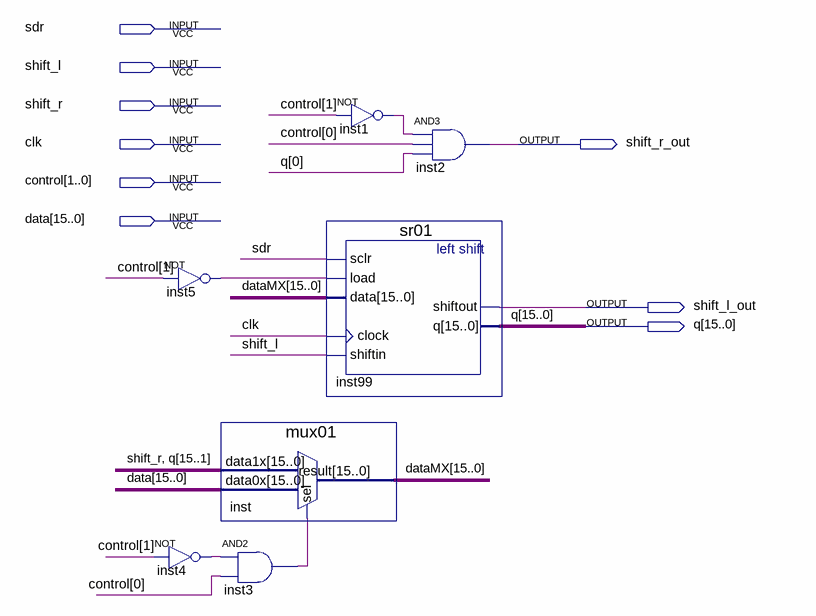
[diagram p0: schematic sheet]
// Quartus schematic b02.bdf as structural Verilog: 7 symbols, 9 pins
module b02 (
  input  sdr,
  input  shift_l,
  input  shift_r,
  input  clk,
  input  [1:0] control,
  input  [15:0] data,
  output shift_r_out,
  output shift_l_out,
  output [15:0] q
);

  wire inst1_out, inst3_out, inst4_out, inst5_out;
  wire [15:0] dataMX;

  not inst5 (inst5_out, control[1]);
  not inst4 (inst4_out, control[1]);
  mux01 inst (.data1x({shift_r, q[15:1]}), .data0x(data), .sel(inst3_out), .result(dataMX));
  and inst3 (inst3_out, inst4_out, control[0]);
  not inst1 (inst1_out, control[1]);
  sr01 inst99 (
    .sclr(sdr), .load(inst5_out), .data(dataMX), .clock(clk), .shiftin(shift_l), .shiftout(shift_l_out), .q(q));
  and inst2 (shift_r_out, inst1_out, control[0], q[0]);
endmodule
